# Altium project HD68_BNC_Breakout.PrjPCB
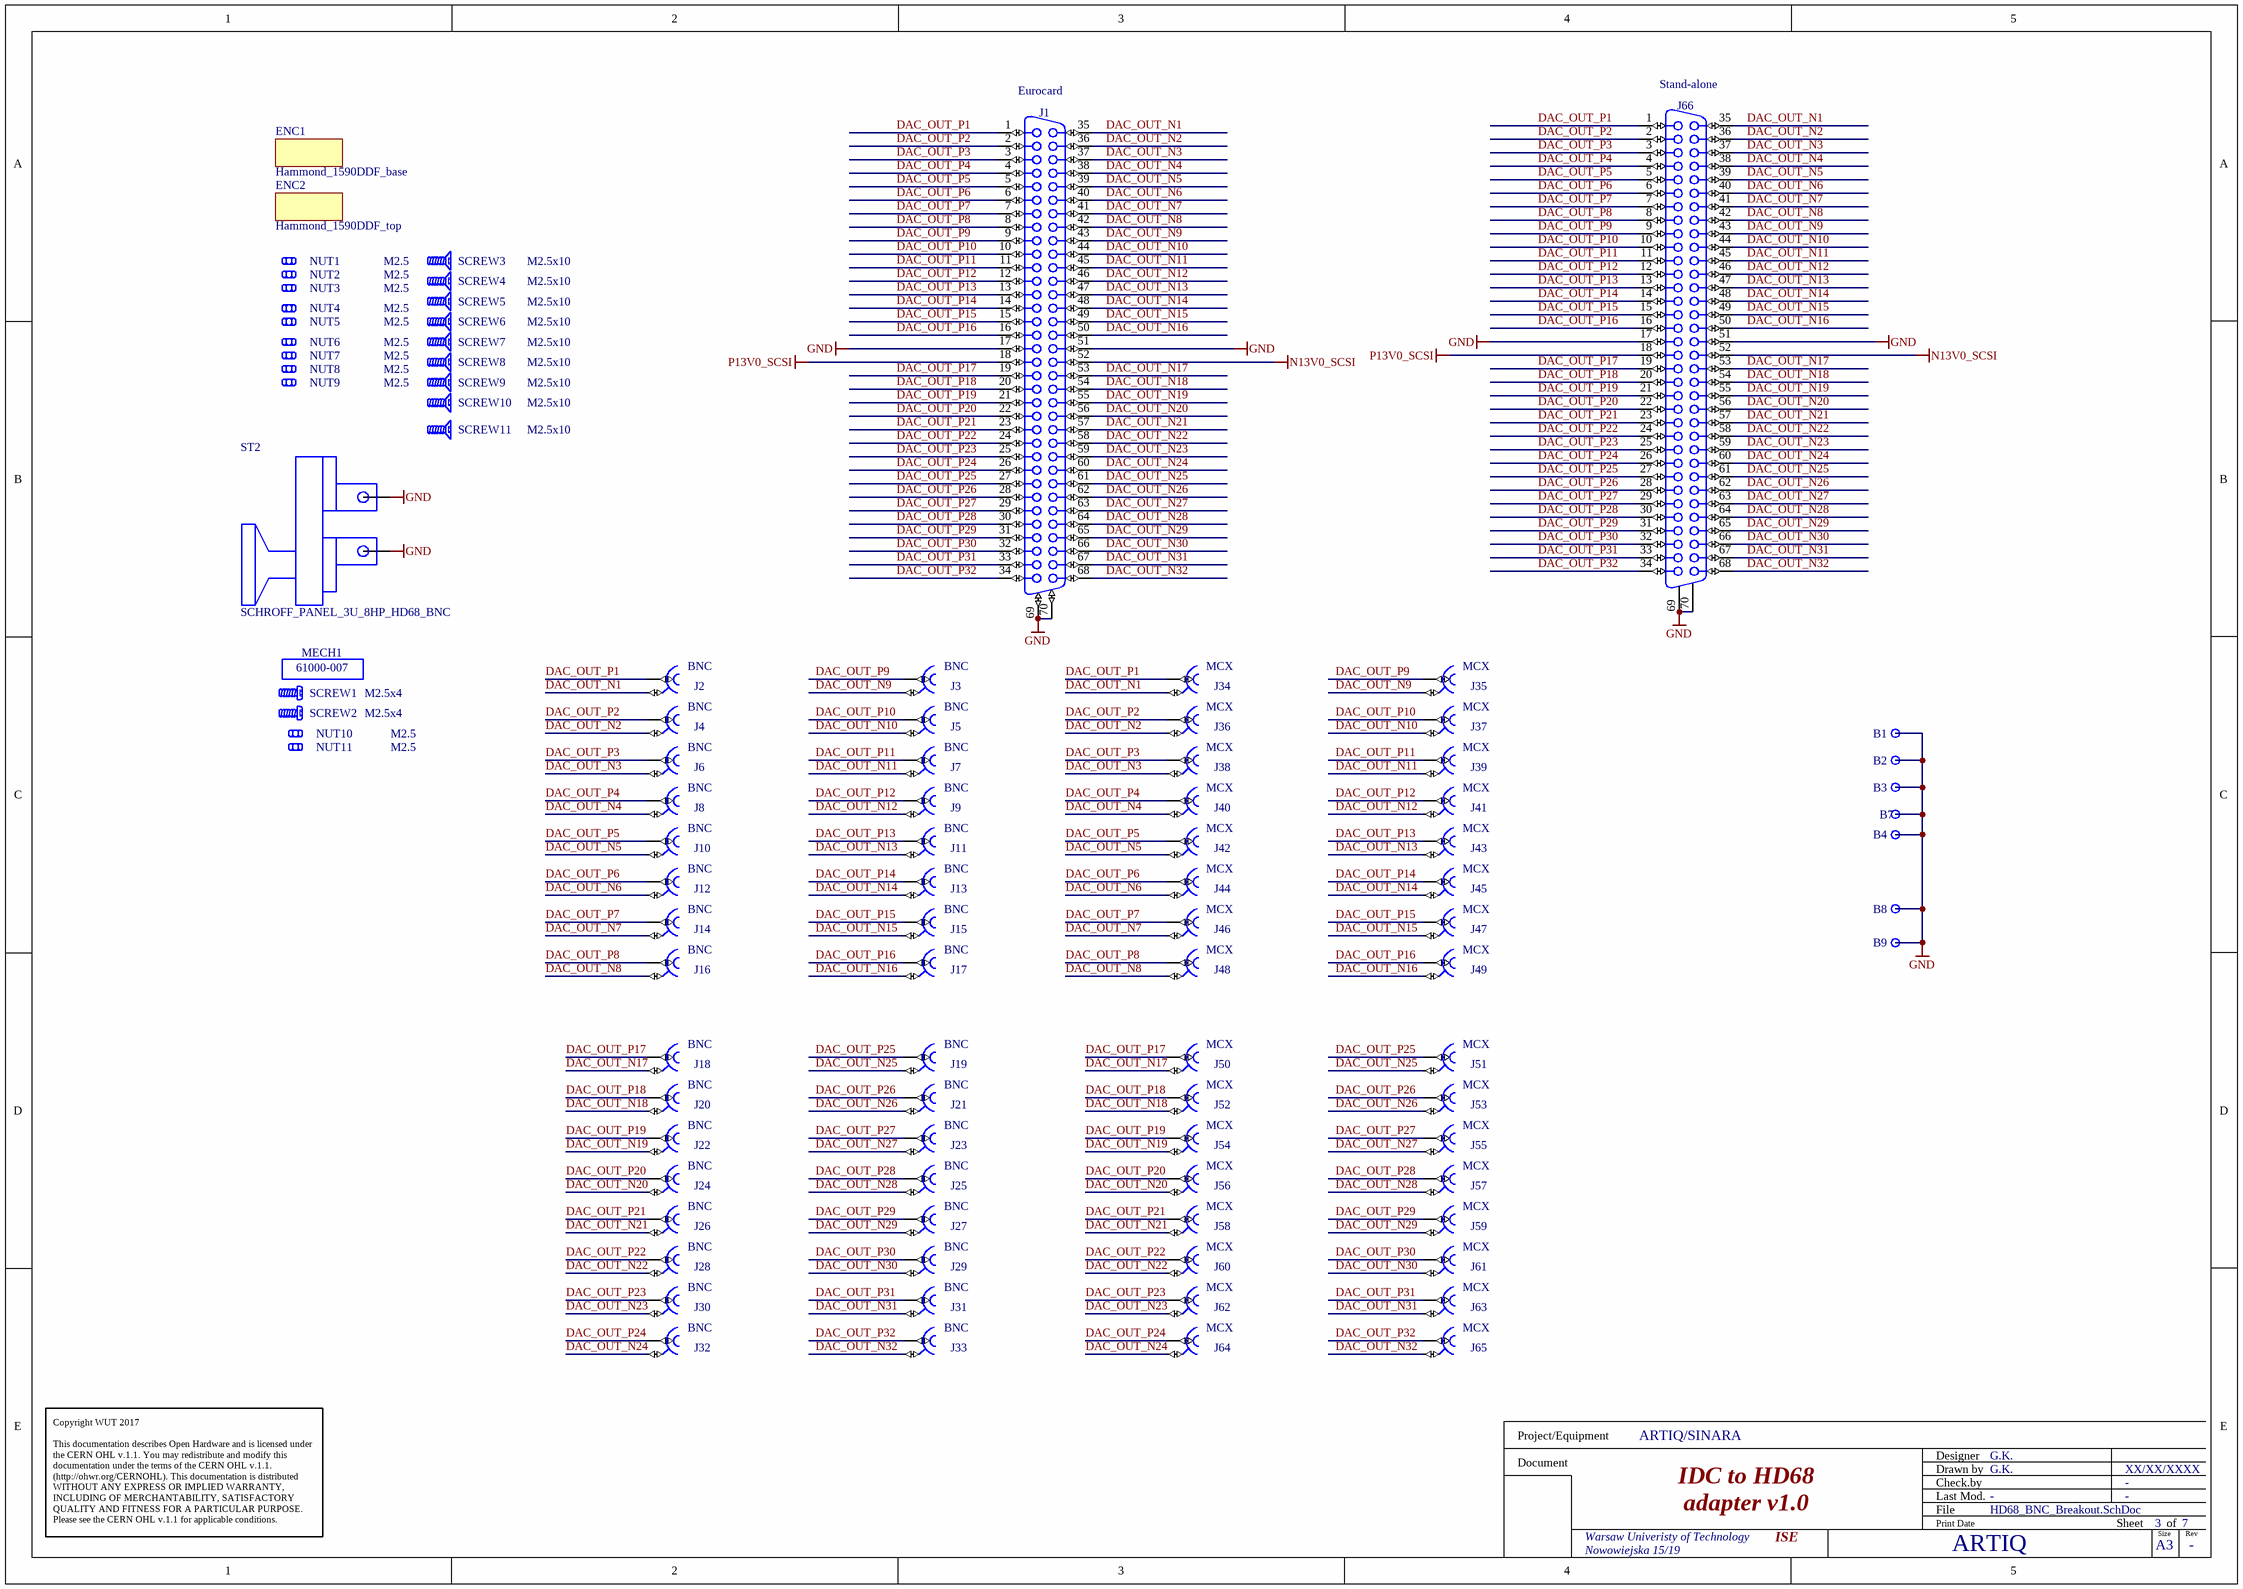
[diagram p0: HD68_BNC_Breakout.SchDoc]
1 sheet, 99 parts. Net scope: global (net labels, ports and power ports of the same name join across sheets).
Board files: HD68_BNC_Breakout.PCBDOC, Panel_HD68_Adapter.PcbDoc, Lid_HD68_BNC_Breakout.PcbDoc, Panel_HD68_Adapter.PcbDoc

## Sheet HD68_BNC_Breakout.SchDoc: IDC to HD68
size 420 x 297 mm; Author: G.K.; CompanyName: WUT; DrawnBy: G.K.; Organization: WUT ISE; Address1: Warsaw Univeristy of Technology; Address2: Nowowiejska 15/19; DocumentNumber: 3; Revision: -; SheetNumber: 3; SheetTotal: 7; EDA_Number: ARTIQ; Projet: ARTIQ/SINARA; ModifiedBy: -; CreateDate: XX/XX/XXXX; CheckedDate: -; Title2: adapter v1.0; DivGrp: ISE; Designer: G.K.; ModifiedDate: -; ProjectName: IDC to HD68 adapter

### Parts
B1  Plated Hole  [MTG270_500]  (value not drawn)  (no BOM)
B2  Plated Hole  [MTG270_500]  (value not drawn)  (no BOM)
B3  Plated Hole  [MTG270_500]  (value not drawn)  (no BOM)
B4  Plated Hole  [MTG270_500]  (value not drawn)  (no BOM)
B7  Plated Hole  [MTG270_500]  (value not drawn)  (no BOM)
B8  Plated Hole  [MTG270_500]  (value not drawn)  (no BOM)
B9  Plated Hole  [MTG270_500]  (value not drawn)  (no BOM)
ENC1  Hammond_1590DDF_base  [1590DDF_base]
ENC2  Hammond_1590DDF_top  [1590D-DD-E_LID_custom]
J1  D-SUB  [TYCO_5787082-7]  (value not drawn)
J2  BNC  [TYCO_5-1634506-1]
J3  BNC  [TYCO_5-1634506-1]
J4  BNC  [TYCO_5-1634506-1]
J5  BNC  [TYCO_5-1634506-1]
J6  BNC  [TYCO_5-1634506-1]
J7  BNC  [TYCO_5-1634506-1]
J8  BNC  [TYCO_5-1634506-1]
J9  BNC  [TYCO_5-1634506-1]
J10  BNC  [TYCO_5-1634506-1]
J11  BNC  [TYCO_5-1634506-1]
J12  BNC  [TYCO_5-1634506-1]
J13  BNC  [TYCO_5-1634506-1]
J14  BNC  [TYCO_5-1634506-1]
J15  BNC  [TYCO_5-1634506-1]
J16  BNC  [TYCO_5-1634506-1]
J17  BNC  [TYCO_5-1634506-1]
J18  BNC  [TYCO_5-1634506-1]
J19  BNC  [TYCO_5-1634506-1]
J20  BNC  [TYCO_5-1634506-1]
J21  BNC  [TYCO_5-1634506-1]
J22  BNC  [TYCO_5-1634506-1]
J23  BNC  [TYCO_5-1634506-1]
J24  BNC  [TYCO_5-1634506-1]
J25  BNC  [TYCO_5-1634506-1]
J26  BNC  [TYCO_5-1634506-1]
J27  BNC  [TYCO_5-1634506-1]
J28  BNC  [TYCO_5-1634506-1]
J29  BNC  [TYCO_5-1634506-1]
J30  BNC  [TYCO_5-1634506-1]
J31  BNC  [TYCO_5-1634506-1]
J32  BNC  [TYCO_5-1634506-1]
J33  BNC  [TYCO_5-1634506-1]
J34  MCX  [AMPHENOL_919-109J-51PX]
J35  MCX  [AMPHENOL_919-109J-51PX]
J36  MCX  [AMPHENOL_919-109J-51PX]
J37  MCX  [AMPHENOL_919-109J-51PX]
J38  MCX  [AMPHENOL_919-109J-51PX]
J39  MCX  [AMPHENOL_919-109J-51PX]
J40  MCX  [AMPHENOL_919-109J-51PX]
J41  MCX  [AMPHENOL_919-109J-51PX]
J42  MCX  [AMPHENOL_919-109J-51PX]
J43  MCX  [AMPHENOL_919-109J-51PX]
J44  MCX  [AMPHENOL_919-109J-51PX]
J45  MCX  [AMPHENOL_919-109J-51PX]
J46  MCX  [AMPHENOL_919-109J-51PX]
J47  MCX  [AMPHENOL_919-109J-51PX]
J48  MCX  [AMPHENOL_919-109J-51PX]
J49  MCX  [AMPHENOL_919-109J-51PX]
J50  MCX  [AMPHENOL_919-109J-51PX]
J51  MCX  [AMPHENOL_919-109J-51PX]
J52  MCX  [AMPHENOL_919-109J-51PX]
J53  MCX  [AMPHENOL_919-109J-51PX]
J54  MCX  [AMPHENOL_919-109J-51PX]
J55  MCX  [AMPHENOL_919-109J-51PX]
J56  MCX  [AMPHENOL_919-109J-51PX]
J57  MCX  [AMPHENOL_919-109J-51PX]
J58  MCX  [AMPHENOL_919-109J-51PX]
J59  MCX  [AMPHENOL_919-109J-51PX]
J60  MCX  [AMPHENOL_919-109J-51PX]
J61  MCX  [AMPHENOL_919-109J-51PX]
J62  MCX  [AMPHENOL_919-109J-51PX]
J63  MCX  [AMPHENOL_919-109J-51PX]
J64  MCX  [AMPHENOL_919-109J-51PX]
J65  MCX  [AMPHENOL_919-109J-51PX]
J66  AMPLIMITE  [TYCO_5749721-7]  (value not drawn)
MECH1  61000-007  [GENERIC_MECH]
NUT1  M2.5  [BOSSARD_BN628-1241427_v]
NUT2  M2.5  [BOSSARD_BN628-1241427_v]
NUT3  M2.5  [BOSSARD_BN628-1241427_v]
NUT4  M2.5  [BOSSARD_BN628-1241427_v]
NUT5  M2.5  [BOSSARD_BN628-1241427_v]
NUT6  M2.5  [BOSSARD_BN628-1241427_v]
NUT7  M2.5  [BOSSARD_BN628-1241427_v]
NUT8  M2.5  [BOSSARD_BN628-1241427_v]
NUT9  M2.5  [BOSSARD_BN628-1241427_v]
NUT10  M2.5  [BOSSARD_BN628-1241427_v]
NUT11  M2.5  [BOSSARD_BN628-1241427_v]
SCREW1  M2.5x4  [BOSSARD_BN5687-3061587_v]
SCREW2  M2.5x4  [BOSSARD_BN5687-3061587_v]
SCREW3  M2.5x10  [BOSSARD_B2.5X10/BN3333_v]
SCREW4  M2.5x10  [BOSSARD_B2.5X10/BN3333_v]
SCREW5  M2.5x10  [BOSSARD_B2.5X10/BN3333_v]
SCREW6  M2.5x10  [BOSSARD_B2.5X10/BN3333_v]
SCREW7  M2.5x10  [BOSSARD_B2.5X10/BN3333_v]
SCREW8  M2.5x10  [BOSSARD_B2.5X10/BN3333_v]
SCREW9  M2.5x10  [BOSSARD_B2.5X10/BN3333_v]
SCREW10  M2.5x10  [BOSSARD_B2.5X10/BN3333_v]
SCREW11  M2.5x10  [BOSSARD_B2.5X10/BN3333_v]
ST2  SCHROFF_PANEL_3U_8HP_HD68_BNC  [SCHROFF_PANEL_3HP_8U - HD68_BNC]

### Nets
GND: B1.1 B2.1 B3.1 B4.1 B7.1 B8.1 B9.1 J1.17 J1.51 J1.69 J1.70 J66.17 J66.51 J66.69 J66.70 ST2.0 ST2.1
N13V0_SCSI: J1.52 J66.52
P13V0_SCSI: J1.18 J66.18
DAC_OUT_N1: J1.35 J2.2 J34.2 J66.35
DAC_OUT_N2: J1.36 J4.2 J36.2 J66.36
DAC_OUT_N3: J1.37 J6.2 J38.2 J66.37
DAC_OUT_N4: J1.38 J8.2 J40.2 J66.38
DAC_OUT_N5: J1.39 J10.2 J42.2 J66.39
DAC_OUT_N6: J1.40 J12.2 J44.2 J66.40
DAC_OUT_N7: J1.41 J14.2 J46.2 J66.41
DAC_OUT_N8: J1.42 J16.2 J48.2 J66.42
DAC_OUT_N9: J1.43 J3.2 J35.2 J66.43
DAC_OUT_N10: J1.44 J5.2 J37.2 J66.44
DAC_OUT_N11: J1.45 J7.2 J39.2 J66.45
DAC_OUT_N12: J1.46 J9.2 J41.2 J66.46
DAC_OUT_N13: J1.47 J11.2 J43.2 J66.47
DAC_OUT_N14: J1.48 J13.2 J45.2 J66.48
DAC_OUT_N15: J1.49 J15.2 J47.2 J66.49
DAC_OUT_N16: J1.50 J17.2 J49.2 J66.50
DAC_OUT_N17: J1.53 J18.2 J50.2 J66.53
DAC_OUT_N18: J1.54 J20.2 J52.2 J66.54
DAC_OUT_N19: J1.55 J22.2 J54.2 J66.55
DAC_OUT_N20: J1.56 J24.2 J56.2 J66.56
DAC_OUT_N21: J1.57 J26.2 J58.2 J66.57
DAC_OUT_N22: J1.58 J28.2 J60.2 J66.58
DAC_OUT_N23: J1.59 J30.2 J62.2 J66.59
DAC_OUT_N24: J1.60 J32.2 J64.2 J66.60
DAC_OUT_N25: J1.61 J19.2 J51.2 J66.61
DAC_OUT_N26: J1.62 J21.2 J53.2 J66.62
DAC_OUT_N27: J1.63 J23.2 J55.2 J66.63
DAC_OUT_N28: J1.64 J25.2 J57.2 J66.64
DAC_OUT_N29: J1.65 J27.2 J59.2 J66.65
DAC_OUT_N30: J1.66 J29.2 J61.2 J66.66
DAC_OUT_N31: J1.67 J31.2 J63.2 J66.67
DAC_OUT_N32: J1.68 J33.2 J65.2 J66.68
DAC_OUT_P1: J1.1 J2.1 J34.1 J66.1
DAC_OUT_P2: J1.2 J4.1 J36.1 J66.2
DAC_OUT_P3: J1.3 J6.1 J38.1 J66.3
DAC_OUT_P4: J1.4 J8.1 J40.1 J66.4
DAC_OUT_P5: J1.5 J10.1 J42.1 J66.5
DAC_OUT_P6: J1.6 J12.1 J44.1 J66.6
DAC_OUT_P7: J1.7 J14.1 J46.1 J66.7
DAC_OUT_P8: J1.8 J16.1 J48.1 J66.8
DAC_OUT_P9: J1.9 J3.1 J35.1 J66.9
DAC_OUT_P10: J1.10 J5.1 J37.1 J66.10
DAC_OUT_P11: J1.11 J7.1 J39.1 J66.11
DAC_OUT_P12: J1.12 J9.1 J41.1 J66.12
DAC_OUT_P13: J1.13 J11.1 J43.1 J66.13
DAC_OUT_P14: J1.14 J13.1 J45.1 J66.14
DAC_OUT_P15: J1.15 J15.1 J47.1 J66.15
DAC_OUT_P16: J1.16 J17.1 J49.1 J66.16
DAC_OUT_P17: J1.19 J18.1 J50.1 J66.19
DAC_OUT_P18: J1.20 J20.1 J52.1 J66.20
DAC_OUT_P19: J1.21 J22.1 J54.1 J66.21
DAC_OUT_P20: J1.22 J24.1 J56.1 J66.22
DAC_OUT_P21: J1.23 J26.1 J58.1 J66.23
DAC_OUT_P22: J1.24 J28.1 J60.1 J66.24
DAC_OUT_P23: J1.25 J30.1 J62.1 J66.25
DAC_OUT_P24: J1.26 J32.1 J64.1 J66.26
DAC_OUT_P25: J1.27 J19.1 J51.1 J66.27
DAC_OUT_P26: J1.28 J21.1 J53.1 J66.28
DAC_OUT_P27: J1.29 J23.1 J55.1 J66.29
DAC_OUT_P28: J1.30 J25.1 J57.1 J66.30
DAC_OUT_P29: J1.31 J27.1 J59.1 J66.31
DAC_OUT_P30: J1.32 J29.1 J61.1 J66.32
DAC_OUT_P31: J1.33 J31.1 J63.1 J66.33
DAC_OUT_P32: J1.34 J33.1 J65.1 J66.34

### Notes on the sheet
- (near J1) Eurocard
- (near J66) Stand-alone
- Copyright WUT 2017
  This documentation describes Open Hardware and is licensed under the CERN OHL v.1.1. You may redistribute and modify this documentation under the terms of the CERN OHL v.1.1. (http://ohwr.org/CERNOHL). This documentation is distributed WITHOUT ANY EXPRESS OR IMPLIED WARRANTY, INCLUDING OF MERCHANTABILITY, SATISFACTORY QUALITY AND FITNESS FOR A PARTICULAR PURPOSE. Please see the CERN OHL v.1.1 for applicable conditions.
- Project/Equipment
- Document
- Designer
- Drawn by
- Check.by
- File
- Last Mod.
- Print Date
- Sheet
- Size
- A3
- of
- Rev

### Library data of the parts
B1-B4 B7-B9 = PLATED_HOLE2.7_PAD5.0: Single Terminal Socket; Part Description: Plated Through Hole: Hole Dia.=2.7mm Pad Dia.=5.0mm; Mounted: No; Part Number: PLATED_HOLE2.7_PAD5.0; Component Type: Standard (No BOM); Pin Count: 1; Family: Plated Hole; Socket: No; SMD: No; Sense: No; Status: None; ComponentHeight: 0mm; HelpURL: Undefined; Author: CERN DEM JMW; CreateDate: 27.09.2011; LatestRevisionDate: 27.09.2011; PackageDescription: Plated Through Hole: Hole Dia.=2.7mm Pad Dia.=5.0mm
ENC1 = Hammond_1590DDF_base: Hammond 1590DDF enclosure base part
ENC2 = Hammond_1590DDF_top_custom: Hammond 1590DDF enclosure lid with custom cutouts
J1 = TYCO_5787082-7: 68 contacts, AMPLIMITE .050", Right Angled Receptacle Series III; Manufacturer: TYCO ELECTRONICS; PressFit: No; Part Number: TYCO_5787082-7; Component Kind: Standard; Component Type: Standard; Pin Count: 70; Family: D-SUB; Mounted: Yes; Socket: No; SMD: No; Sense: No; Status: None; Part Description: 68 contacts, AMPLIMITE .050", Right Angled Receptacle Series III; Manufacturer Part Number: 5787082-7; ComponentHeight: 9.5mm; HelpURL: \\cern.ch\dfs\Applications\Altium\Datasheets\TYCO_5787082-7.pdf; Author: CERN DEM JLC; CreateDate: 13.03.2017; LatestRevisionDate: 13.03.2017
J2-J33 = TYCO_5-1634506-1: Part Description: 50 Ohms BNC PCB Straight Socket; Manufacturer: TYCO ELECTRONICS; PressFit: No; Part Number: TYCO_5-1634506-1; Component Kind: Standard; Component Type: Standard; Pin Count: 2; Family: BNC; Mounted: Yes; Socket: No; SMD: No; Sense: No; Status: None; Manufacturer Part Number: 5-1634506-1; ComponentHeight: 16.7mm; HelpURL: \\cern.ch\dfs\Applications\Altium\Datasheets\TYCO_5-1634506-1.pdf; Author: CERN DEM JLC; CreateDate: 14.02.2011; LatestRevisionDate: 14.02.2011
J34-J65 = AMPHENOL_919-109J-51PX: Part Description: 50 Ohm, RF Connector, MCX Straight PCB Receptacle Jack; Manufacturer Part Number: 919-109J-51PX (MCX6251B1-3GT30G-50); PressFit: No; Part Number: AMPHENOL_919-109J-51PX; Component Kind: Standard; Component Type: Standard; Pin Count: 5; Family: MCX; Mounted: Yes; Socket: No; SMD: No; Sense: No; Status: None; Manufacturer: AMPHENOL; ComponentHeight: 6.06mm; HelpURL: \\cern.ch\dfs\Applications\Altium\Datasheets\AMPHENOL_919-109J-51PX.pdf; Author: CERN DEM BC; CreateDate: 31.01.2019; LatestRevisionDate: 31.01.2019
J66 = TYCO_5749721-7: AMPLIMITE .050 Series, 68 Positions Vertical Receptacle; Manufacturer: TYCO ELECTRONICS; PressFit: No; Part Number: TYCO_5749721-7; Component Kind: Standard; Component Type: Standard; Pin Count: 70; Family: AMPLIMITE; Mounted: Yes; Socket: No; SMD: No; Sense: No; Status: None; Part Description: AMPLIMITE .050 Series, 68 Positions Vertical Receptacle; Manufacturer Part Number: 5749721-7; ComponentHeight: 8.92mm; HelpURL: \\cern.ch\dfs\Applications\Altium\Datasheets\TYCO_5749721-7.pdf; Author: CERN DEM HF; CreateDate: 25.07.2022; LatestRevisionDate: 25.07.2022
MECH1 = Generic_mechanical: PCB Solder Side Cover, 3 U, 100 mm x 160 mm, 55°C Schroff insulating plate; PressFit: No; Part Number: 61000-007; Component Kind: Accessories; Component Type: Standard; Footprint: generic_MECH; Pin Count: 0; PackageDescription: generic; Mounted: Yes; Socket: No; SMD: No; Sense: No; Status: None; Value: 61000-007; Part Description: PCB Solder Side Cover, 3 U, 100 mm x 160 mm, 55°C Schroff insulating plate; Manufacturer: Schroff; Manufacturer Part Number: 61000-007; ComponentHeight: generic; Author: GK; CreateDate: 28.10.2019; LatestRevisionDate: 28.10.2019
NUT1-NUT11 = BOSSARD_BN628-1241427_v: Nut; Part Description: M2.5 Hexagon Nut ~0,8d, ISO 4032 - DIN 934, Stainless Steel A2; Manufacturer Part Number: BN628 Art.1241427; PressFit: No; Part Number: BOSSARD_BN628-1241427_v; Component Kind: Standard; Component Type: Mechanical; Pin Count: 0; PackageDescription: M2.5 Hexagon Nut ~0,8d, ISO 4032 - DIN 934, Stainless Steel A2; Mounted: Yes; Socket: No; SMD: No; Sense: No; Status: None; Value: M2.5; Manufacturer: BOSSARD; ComponentHeight: 2mm; HelpURL: \\cern.ch\dfs\Applications\Altium\Datasheets\BOSSARD_BN628-1241427.pdf; Author: CERN DEM JMW; CreateDate: 04.12.2015; LatestRevisionDate: 04.12.2015
SCREW1 SCREW2 = BOSSARD_BN5687-3061587_v: Screw; Part Description: M2.5 L=4mm Hexalobular Socket Pan Head Screw, Fully Threaded, Stainless Steel A2; Manufacturer Part Number: BN5687 Art.3061587; PressFit: No; Part Number: BOSSARD_BN5687-3061587_v; Component Kind: Standard; Component Type: Mechanical; Pin Count: 0; PackageDescription: M2.5 L=4mm Hexalobular Socket Pan Head Screw, Fully Threaded - Stainless Steel A2; Mounted: Yes; Socket: No; SMD: No; Sense: No; Status: None; Value: M2.5x4; Manufacturer: BOSSARD; ComponentHeight: 5mm; HelpURL: \\cern.ch\dfs\Applications\Altium\Datasheets\BOSSARD_BN5687-3061587.pdf; Author: CERN DEM JLC; CreateDate: 22.08.2013; LatestRevisionDate: 22.08.2013
SCREW3-SCREW11 = Screw_M2.5x10_Countersunk_v: Screw; 2.5x10; Head: countersunk; Philips; A1 steel; Part Number: BOSSARD_B2.5X10/BN3333; Part Description: M2.5 L=10mm  countersunk; Pozidriv Pan Head Screw, Fully Threaded, zinc Steel; Manufacturer: BOSSARD; Manufacturer Part Number: B2.5X10/BN3333; PressFit: No; Component Kind: Standard; Component Type: Mechanical; Footprint: BOSSARD_B2.5X10/BN3333_h; Pin Count: 0; PackageDescription: M2.5 L=10mm Countersunk Posidriv Screw, Fully Threaded - Steel zinc; Mounted: Yes; Socket: No; SMD: No; Sense: No; Status: None; Value: M2.5x10; ComponentHeight: 5.6mm; HelpURL: \\cern.ch\dfs\Applications\Altium\Datasheets\BOSSARD_BN5687-3061605.pdf; Author: GK; CreateDate: 15/01/2013; LatestRevisionDate: 15/01/2013
ST2 = SCHROFF_PANEL_3U_8HP_HD68_BNC: Schroff 8HP 3U EUROCARD Panel; Manufacturer Part Number: 20849107; Manufacturer: Schroff

## Assembly variants
MCX_3U: not fitted ENC1 ENC2 J2 J3 J4 J5 J6 J7 J8 J9 J10 J11 J12 J13 J14 J15 J16 J17 J18 J19 J20 J21 J22 J23 J24 J25 J26 J27 J28 J29 J30 J31 J32 J33 J66 NUT1 NUT2 NUT3 NUT4 NUT5 NUT6 NUT7 NUT8 NUT9 SCREW3 SCREW4 SCREW5 SCREW6 SCREW7 SCREW8 SCREW9 SCREW10 SCREW11
STD_BNC: not fitted J1 J34 J35 J36 J37 J38 J39 J40 J41 J42 J43 J44 J45 J46 J47 J48 J49 J50 J51 J52 J53 J54 J55 J56 J57 J58 J59 J60 J61 J62 J63 J64 J65 MECH1 NUT10 NUT11 SCREW1 SCREW2 ST2